# Altium schematic sheet TIDA-010954-Power.SchDoc
size 431 x 279 mm; Date: Not shown in title block; ApprovedBy: Not shown in title block; CheckedBy: Not shown in title block; Author: Not shown in title block; CompanyName: Not shown in title block; Engineer: Not shown in title block; Organization: Not shown in title block; Address1: Not shown in title block; Address2: Not shown in title block; Address3: Not shown in title block; Address4: Not shown in title block; DocumentNumber: 2; Revision: Use project parameter SCH_Rev; SheetNumber: 6; SheetTotal: 9; PageSetup: Record=PageOptions|CenterHorizontal=True|CenterVertical=True|PrintScale=1.00|XCorrection=1.00|YCorrection=1.00|PrintKind=0|BorderSize=5000000|LeftOffset=0|BottomOffset=0|Orientation=2|PaperLength=1000|PaperWidth=1000|Scale=100|PaperSource=15|PrintQuality=600|MediaType=1|DitherType=10|PaperKind=Letter|PrintScaleMode=1; CurrentTime: Not shown in title block; CurrentDate: Not shown in title block; Time: Not shown in title block; DocumentFullPathAndName: Not shown in title block; DocumentName: Not shown in title block; ModifiedDate: 1/25/2022; ImagePath: Not shown in title block
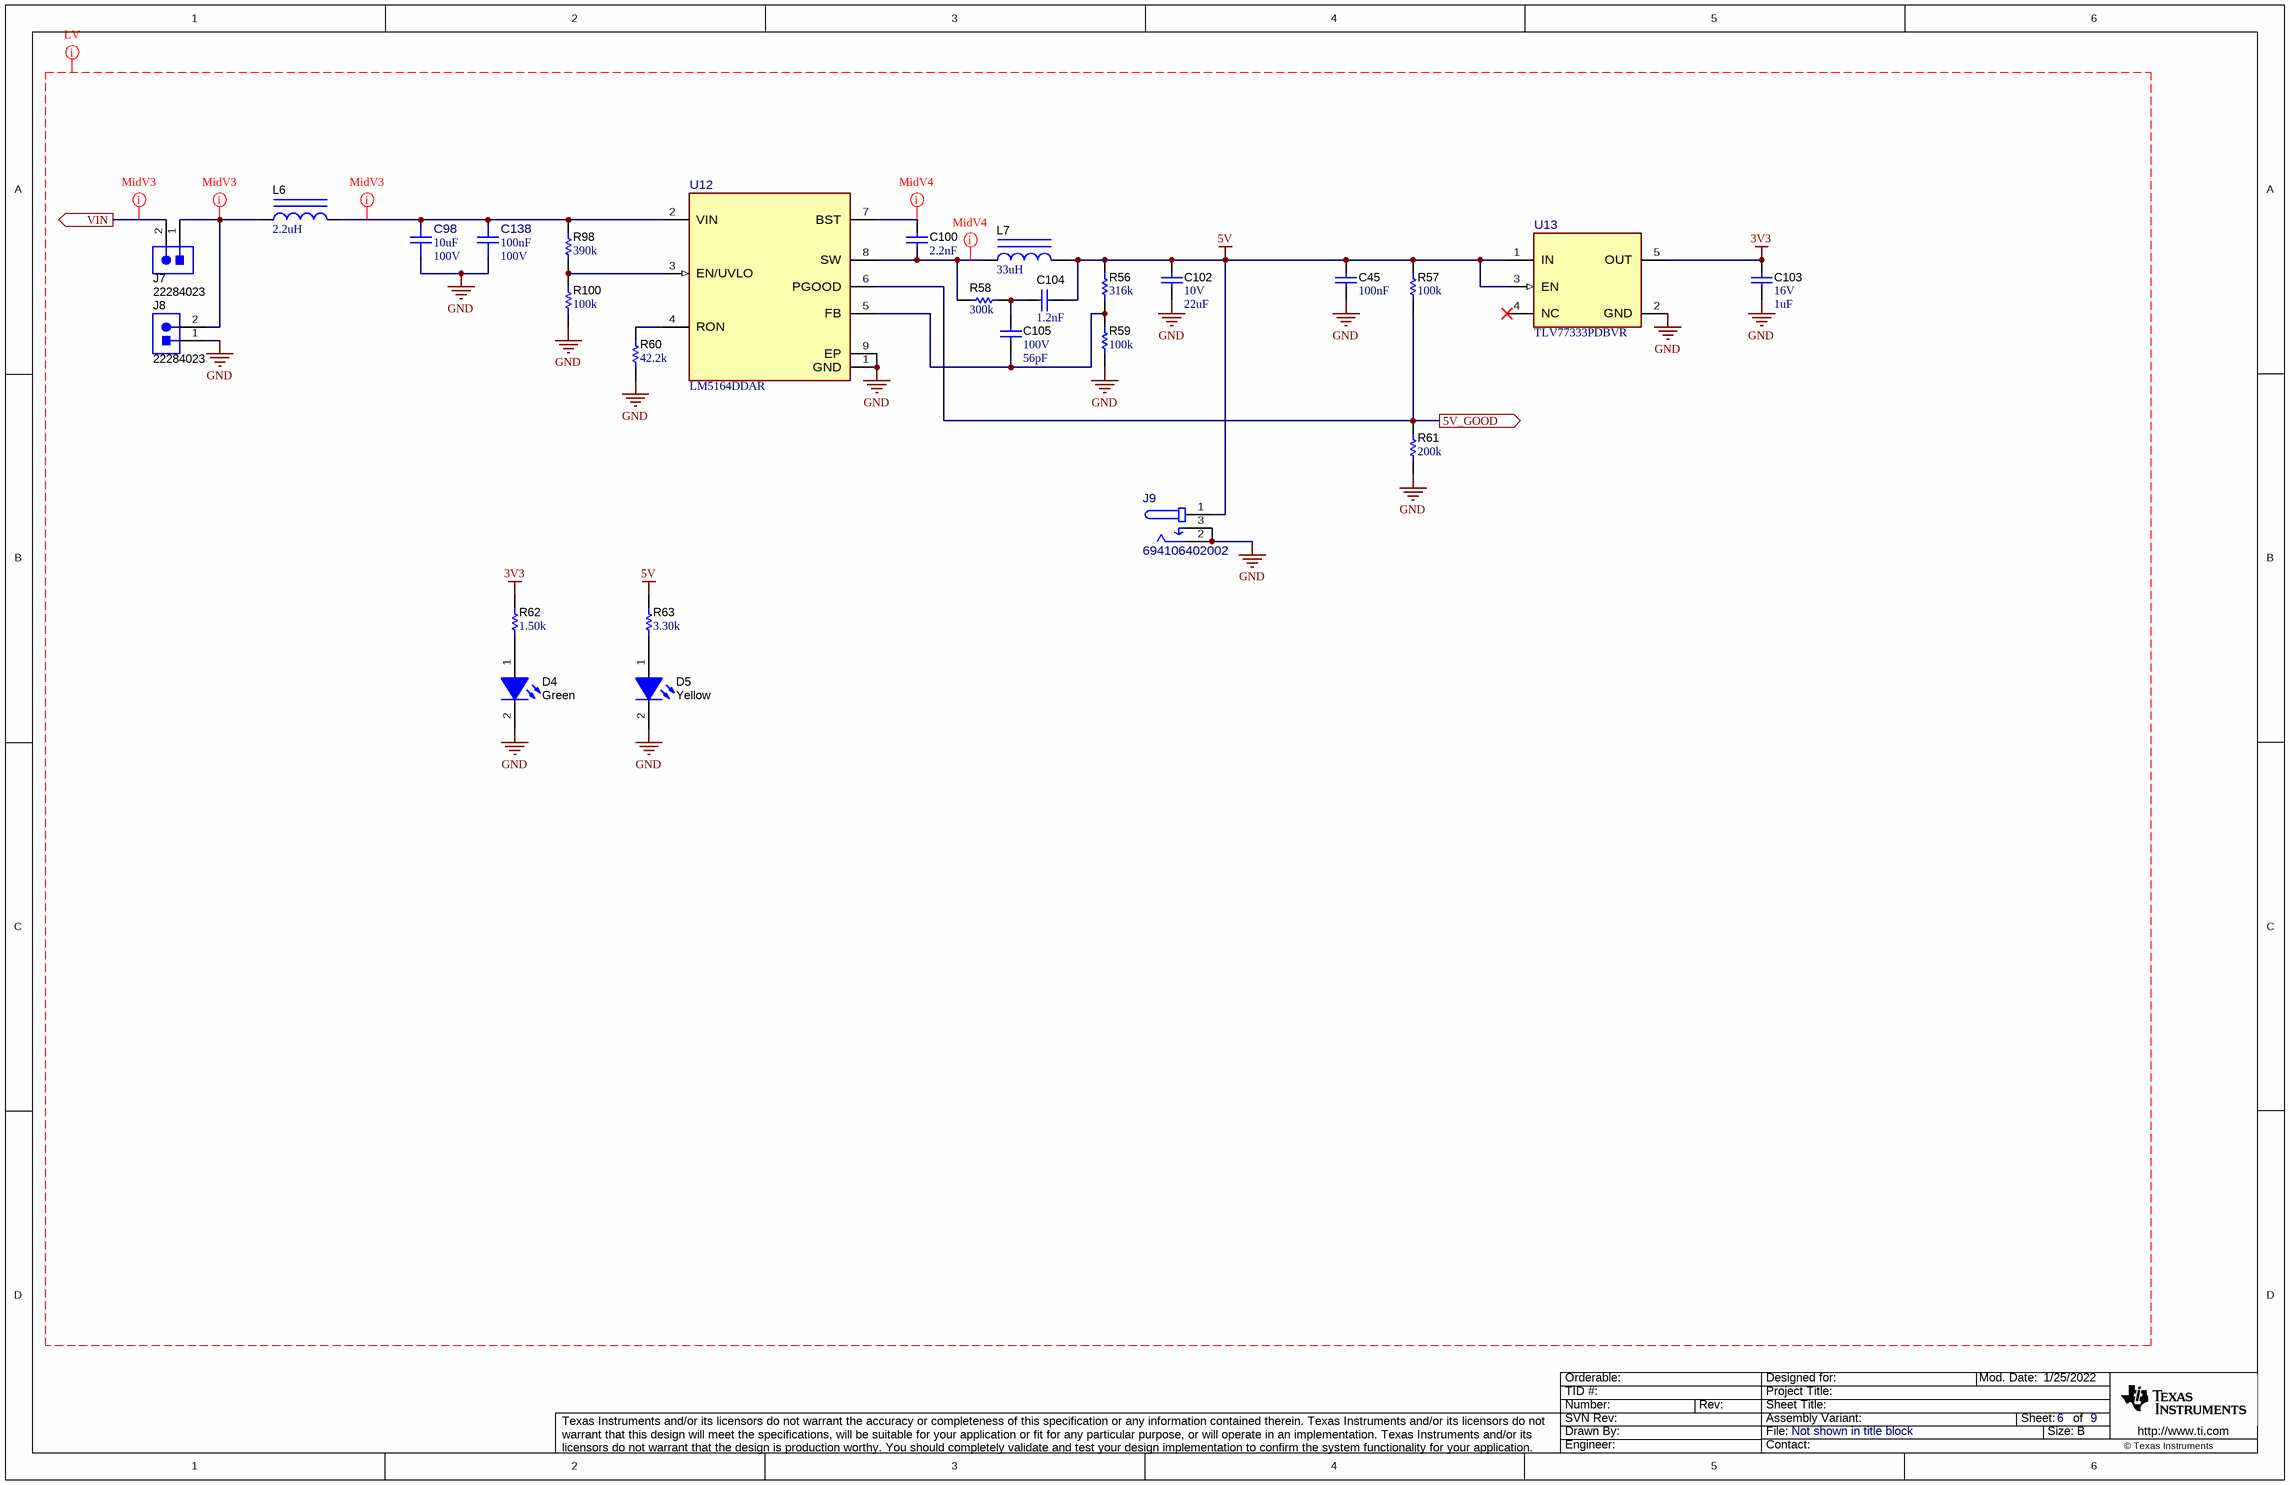
[diagram p0: TIDA-010954-Power.SchDoc]

## Parts
C45  Cap_F: 100nF  [0603]  (hidden comment: CGA3E2X7R1E104K080AA)
C98  ValueDisplayed: 10uF  VDC_V: 100V  [FP-GRM32EC72A106KE05L_1210-MFG]  (hidden comment: GRM32EC72A106KE05L)
C100  Cap_F: 2.2nF  [0603]  (hidden comment: C0603C222K5RAC)
C102  VDC_V: 10V  ValueDisplayed: 22uF  [1206_180]  (hidden comment: GRM31CR71A226KE15L)
C103  VDC_V: 16V  ValueDisplayed: 1uF  [0603]  (hidden comment: GRM185R61C105KE44D)
C104  Cap_F: 1.2nF  [0603]  (hidden comment: GRM188R72A122KA01D)
C105  VDC_V: 100V  ValueDisplayed: 56pF  [0603]  (hidden comment: GRM1885C2A560JA01D)
C138  Cap_F: 100nF  VDC_V: 100V  [FP-GRM188R72A104KA35J_0603-MFG]  (hidden comment: GRM188R72A104KA35J)
D4  value Green  [APT1608_Green]  (hidden comment: APT1608MGC)
D5  value Yellow  [APT1608_Yellow]  (hidden comment: APT1608SYCK)
J7  22284023  [Molex_0022284023]
J8  22284023  [Molex_0022284023]
J9  694106402002  [FP-694106402002_CONN_PWR_10MM7_9MM0-MFG]
L6  ValueDisplayed: 2.2uH  [0805_HV]  (hidden comment: LQM21PN2R2MGS)
L7  ValueDisplayed: 33uH  [SRR1210]  (hidden comment: SRR1210-330M)
R56  ValueDisplayed: 316k  [0603]  (hidden comment: RC0603FR-07316KL)
R57  ValueDisplayed: 100k  [0603]  (hidden comment: RC0603FR-07100KL)
R58  ValueDisplayed: 300k  [0805_HV]  (hidden comment: CRCW0805300KJNEA)
R59  ValueDisplayed: 100k  [0603]  (hidden comment: RC0603FR-07100KL)
R60  ValueDisplayed: 42.2k  [0603]  (hidden comment: RC0603FR-0742K2L)
R61  ValueDisplayed: 200k  [0603]  (hidden comment: RC0603FR-07200KL)
R62  ValueDisplayed: 1.50k  [0603]  (hidden comment: RC0603FR-071K5L)
R63  ValueDisplayed: 3.30k  [0603]  (hidden comment: RC0603FR-073K3L)
R98  ValueDisplayed: 390k  [0805_HV]  (hidden comment: CRCW0805390KJNEA)
R100  ValueDisplayed: 100k  [0603]  (hidden comment: RC0603FR-07100KL)
U12  LM5164DDAR  [DDA0008E-MFG]
U13  TLV77333PDBVR  [DBV0005A-MFG]

## Ports
5V_GOOD (out), VIN (out)

## Nets
3V3: C103.1 R62.2 U13.5(OUT)
5V: C45.2 C102.1 C104.1 J9.1 L7.2 R56.2 R57.2 R63.2 U13.1(IN) U13.3(EN)
GND: C45.1 C98.1 C102.2 C103.2 C138.1 D4.2(K) D5.2(K) J8.1 J9.2 J9.3 R59.1 R60.1 R61.1 R100.1 U12.1(GND) U12.9(EP) U13.2(GND)
5V_GOOD: R57.1 R61.2 U12.6(PGOOD) ; port 5V_GOOD
VIN: J7.2 ; port VIN
NetC98_2: C98.2 C138.2 L6.2 R98.2 U12.2(VIN)
NetC100_1: C100.1 U12.7(BST)
NetC100_2: C100.2 L7.1 R58.1 U12.8(SW)
NetC104_2: C104.2 C105.1 R58.2
NetC105_2: C105.2 R56.1 R59.2 U12.5(FB)
NetD4_1: D4.1(A) R62.1
NetD5_1: D5.1(A) R63.1
NetJ7_1: J7.1 J8.2 L6.1
NetR60_2: R60.2 U12.4(RON)
NetR98_1: R98.1 R100.2 U12.3(EN/UVLO)

Not connected (* = marked no-connect by the designer): U13 4(NC)*

## Layout directives
net class LV: 3V3, 5V, GND
net class MidV3: NetC98_2, NetC100_1, NetC100_2, NetJ7_1, VIN

## Notes on the sheet
- Drawn By:
- SVN Rev:
- Number:
- TID #:
- Orderable:
- Rev:
- Sheet Title:
- File:
- Project Title:
- Designed for:
- Assembly Variant:
- Mod. Date:
- Sheet:
- Size:
- of
- B
- http://www.ti.com
- Texas Instruments and/or its licensors do not warrant the accuracy or completeness of this specification or any information contained therein. Texas Instruments and/or its licensors do not warrant that this design will meet the specifications, will be suitable for your application or fit for any particular purpose, or will operate in an implementation. Texas Instruments and/or its licensors do not warrant that the design is production worthy. You should completely validate and test your design implementation to confirm the system functionality for your application.
- Engineer:
- Contact:
- © Texas Instruments

## Library data of the parts
C45 = CMP-0007077-5: CAP, CERM, 0.1 uF, 25 V, +/- 10%, X7R, AEC-Q200 Grade 1, 0603; Manufacturer: TDK; TaMin_C: -55°C; Polarized: N; SizeAreaWB_mm2: 4.68; Value1: Unknown; U/M: EA; Value: 0.1uF; TaMax_C: 125°C; SizeZ_mm: 1; SizeX_mm: 1.6; SizeY_mm: 0.8; Value2: 25V; SizeArea_mm2: 1.28; AEC Qualified: Y; AEC Category: Q200; Supplier Part Number 2: 79Y4100; Publisher: Texas Instruments; Supplier 2: Newark; Supplier Part Number 3: 810-CGA3E2X7R1E104K; TempCo: X7R; Supplier 3: Mouser; Published: 2008-06-19; RoHS: Y; MountType: SMT; Supplier 1: Digi-Key; PackageReference: 0603; Tolerance_%: 10%; Cap_Case: 0603; CompType: Capacitor; LatestRevisionDate: 2017-03-09; PartNumber: CGA3E2X7R1E104K080AA; VDC_V: 25V; ComponentLink1Description: Datasheet link; AEC Grade: 1; Supplier Part Number 1: 445-5667-1-ND; Technology: Ceramic; ValueDisplayed: 0.1uF; ComponentLink1URL: https://product.tdk.com/info/en/documents/chara_sheet/CGA3E2X7R1E104K080AA.pdf
C98 = CMP-0087970-1: 10µF ±10% 100V Ceramic Capacitor X7S 1210 (3225 Metric); Manufacturer: Murata; Symbol Name: SYM-GRM32EC72A106KE05L; Tolerance_%: 0.1; AEC Qualified: No; TempCo: 22%; SizeZ_mm: 2.7mm; RoHS: TRUE; ComponentLink1Description: Datasheet; ComponentLink1URL: https://search.murata.co.jp/Ceramy/image/img/A01X/G101/ENG/GRM32EC72A106KE05-01A.pdf; PackageReference: 1210; PartNumber: GRM32EC72A106KE05L; Cap_F: 10µF
C100 = CMP-0006897-4: CAP, CERM, 2200 pF, 50 V, +/- 10%, X7R, 0603; Manufacturer: Kemet; TaMin_C: -55°C; Polarized: N; SizeAreaWB_mm2: 4.68; Value1: Unknown; U/M: EA; Value: 2200pF; TaMax_C: 125°C; SizeZ_mm: 1; SizeX_mm: 1.6; SizeY_mm: 0.8; Value2: 50V; SizeArea_mm2: 1.28; AEC Category: Q200; Publisher: Texas Instruments; TempCo: X7R; Published: 2008-06-19; RoHS: Y; MountType: SMT; Supplier 1: Farnell; PackageReference: 0603; Tolerance_%: 10%; Cap_Case: 0603; CompType: Capacitor; LatestRevisionDate: 2017-03-09; PartNumber: C0603C222K5RAC; AEC Qualified: ?; VDC_V: 50V; ComponentLink1Description: Datasheet link; Supplier Part Number 1: 1362428; Technology: Ceramic; ValueDisplayed: 2200pF; ComponentLink1URL: http://www.kemet.com/kemet/web/homepage/kechome.nsf/vapubfiles/F3102_Y5V.pdf/$file/F3102_Y5V.pdf
C102 = CMP-0008959-2: CAP, CERM, 22 uF, 10 V, +/- 10%, X7R, 1206; Manufacturer: MuRata; TaMin_C: -55°C; Polarized: N; SizeAreaWB_mm2: 10.92; Value1: Unknown; U/M: EA; Value: 22uF; TaMax_C: 125°C; SizeZ_mm: 1.8; SizeX_mm: 3.2; SizeY_mm: 1.6; Cap_Case: 1206; SizeArea_mm2: 5.12; Cap_F: 22µF; AEC Category: Q200; Supplier Part Number 2: 81-GRM31CR71A226K15L; Publisher: Texas Instruments; Supplier 2: Mouser; Supplier Part Number 3: 1797016; TempCo: X7R; Supplier 3: Farnell; Published: 2008-06-19; RoHS: Y; MountType: SMT; Supplier 1: Digi-Key; PackageReference: 1206; Tolerance_%: 10%; Value2: 10V; CompType: Capacitor; LatestRevisionDate: 2017-03-09; PartNumber: GRM31CR71A226KE15L; AEC Qualified: ?; ComponentLink1Description: Datasheet link; Supplier Part Number 1: 490-5309-1-ND; Technology: Ceramic; ComponentLink1URL: http://search.murata.co.jp/Ceramy/PnsearchViewAction.do?HnOFG=ON&HnNFG=ON&SEL_CNT=50&sLang=en&sKey=GRM31CR71A226KE15L&x=9&y=9&search=startwith
C103 = CMP-0007157-5: CAP, CERM, 1 uF, 16 V, +/- 10%, X5R, 0603; Manufacturer: MuRata; TaMin_C: -55°C; Polarized: N; SizeAreaWB_mm2: 4.68; Value1: Unknown; U/M: EA; Value: 1uF; TaMax_C: 85°C; SizeZ_mm: 1; SizeX_mm: 1.6; SizeY_mm: 0.8; SizeArea_mm2: 1.28; Cap_F: 1µF; AEC Category: Q200; Supplier Part Number 2: 81-GRM185R61C105KE44; Publisher: Texas Instruments; Supplier 2: Mouser; Supplier Part Number 3: 1845733; TempCo: X5R; Supplier 3: Farnell; Published: 2008-06-19; RoHS: Y; MountType: SMT; Supplier 1: Digi-Key; PackageReference: 0603; Tolerance_%: 10%; Cap_Case: 0603; Value2: 16V; CompType: Capacitor; LatestRevisionDate: 2017-03-09; PartNumber: GRM185R61C105KE44D; AEC Qualified: ?; ComponentLink1Description: Datasheet link; Supplier Part Number 1: 490-3894-1-ND; Technology: Ceramic; ComponentLink1URL: http://search.murata.co.jp/Ceramy/PnsearchViewAction.do?HnOFG=ON&HnNFG=ON&SEL_CNT=50&sLang=en&sKey=GRM185R61C105KE44D&x=9&y=9&search=startwith
C104 = CMP-0007471-5: CAP, CERM, 1200 pF, 100 V, +/- 10%, X7R, 0603; Manufacturer: MuRata; TaMin_C: -55°C; Polarized: N; SizeAreaWB_mm2: 4.68; Value1: Unknown; U/M: EA; Value: 1200pF; TaMax_C: 125°C; SizeZ_mm: 1; SizeX_mm: 1.6; SizeY_mm: 0.8; Value2: 100V; SizeArea_mm2: 1.28; AEC Category: Q200; Supplier Part Number 2: 81-GRM18R72A122KA01D; Publisher: Texas Instruments; Supplier 2: Mouser; TempCo: X7R; Published: 2008-06-19; RoHS: Y; MountType: SMT; Supplier 1: Digi-Key; PackageReference: 0603; Tolerance_%: 10%; Cap_Case: 0603; CompType: Capacitor; LatestRevisionDate: 2017-03-09; PartNumber: GRM188R72A122KA01D; AEC Qualified: ?; VDC_V: 100V; ComponentLink1Description: Datasheet link; Supplier Part Number 1: 490-1474-1-ND; Technology: Ceramic; ValueDisplayed: 1200pF; ComponentLink1URL: http://search.murata.co.jp/Ceramy/PnsearchViewAction.do?HnOFG=ON&HnNFG=ON&SEL_CNT=50&sLang=en&sKey=GRM188R72A122KA01D&x=9&y=9&search=startwith
C105 = CMP-0007275-4: CAP, CERM, 56 pF, 100 V, +/- 5%, C0G/NP0, 0603; Manufacturer: MuRata; TaMin_C: -55°C; Polarized: N; SizeAreaWB_mm2: 4.68; Value1: Unknown; U/M: EA; Value: 56pF; TaMax_C: 125°C; SizeZ_mm: 1; SizeX_mm: 1.6; SizeY_mm: 0.8; SizeArea_mm2: 1.28; AEC Category: Q200; Supplier Part Number 2: 81-GRM185C2A560JA01D; Publisher: Texas Instruments; Supplier 2: Mouser; TempCo: C0G/NP0; Published: 2008-06-19; RoHS: Y; MountType: SMT; Supplier 1: Digi-Key; PackageReference: 0603; Tolerance_%: 5%; Cap_Case: 0603; Value2: 100V; CompType: Capacitor; LatestRevisionDate: 2017-03-09; PartNumber: GRM1885C2A560JA01D; Cap_F: 56pF; ComponentLink1Description: Datasheet link; Supplier Part Number 1: 490-1345-1-ND; Technology: Ceramic; AEC Qualified: ?; ComponentLink1URL: http://search.murata.co.jp/Ceramy/PnsearchViewAction.do?HnOFG=ON&HnNFG=ON&SEL_CNT=50&sLang=en&sKey=GRM1885C2A560JA01D&x=9&y=9&search=startwith
C138 = CMP-0122713-1: Chip Multilayer Ceramic Capacitors for General Purpose, 0603, 0.10uF, X7R, 15%, 10%, 100V; Manufacturer: Murata; AEC Qualified: No; SizeZ_mm: 0.9mm; Value: 100nF; PackageReference: 0603; PartNumber: GRM188R72A104KA35J; RoHS: TRUE; TempCo: 15%; Tolerance_%: 10%; ValueDisplayed: 0.10uF; Part Number: GRM188R72A104KA35J; datasheet: https://www.murata.com/en-us/products/productdetail?partno=GRM188R72A104KA35%23; Datasheet Path: datasheets/Cap-GRM188R72A104KA35J.pdf; helpURL: https://upverter.com/upn/revision/71520f38ae33ed89/; Lead Free: Yes; Operating Temperature Range: -55°C to +125°C; Temperature Characteristic: X7R; ComponentLink1Description: Datasheet; ComponentLink1URL: https://www.murata.com/en-us/products/productdetail?partno=GRM188R72A104KA35%23
D4 = CMP-0002943-3: LED, Green, SMD; Manufacturer: Kingbright; Value2: 2.1V; Vr_V: 5V; Ir_A: 10µA; Io_A: 20mA; Angle: 120; Tjmax_C: 85°C; Value1: W; CompType: LED; MountType: SMT; Color: Green; ComponentLink1Description: Datasheet link; PackageReference: 0603(1608); RoHS: Y; PartNumber: APT1608MGC; Vf_V: 2.1V; Type: ?; ComponentLink1URL: http://www.kingbrightusa.com/images/catalog/SPEC/APT1608MGC.pdf
D5 = CMP-0002944-3: LED, Yellow, SMD; Manufacturer: Kingbright; Value2: 2.5V; Ir_A: 10µA; Tjmax_C: 85°C; Value1: W; Io_A: 20mA; Vr_V: 5V; Angle: 120; Color: yellow; CompType: LED; MountType: SMT; RoHS: Y; ComponentLink1URL: http://www.kingbrightusa.com/images/catalog/SPEC/APT1608SYCK.pdf; Type: ?; PackageReference: 0603(1608); ComponentLink1Description: Datasheet link; Vf_V: 2.5V; PartNumber: APT1608SYCK
J7 J8 = CMP-0055333-1: Header, 2.54mm, 2x1, Tin, TH; Manufacturer: Molex; CNHeader: TRUE; Current_A: 4A; Shrouded: N; Gender: Male; Voltage_V: 250V; Row_Count: 1; Pitch_mm: 2.54; CT: FALSE; Cert_UL: Y; ComponentLink1URL: http://www.molex.com/pdm_docs/sd/022284023_sd.pdf; ClassName: Header; Publisher: Texas Instruments; Color: Black; RoHS: Y; MountType: TH; Supplier 1: Digi-Key; PackageReference: Header, 2.54mm, 2x1, TH; PinCount: 2; CompType: Header; LatestRevisionDate: 26/05/2017; PartNumber: 22284023; Orientation: Vertical; ComponentLink1Description: Datasheet URL; Supplier Part Number 1: WM50016-02-ND; ContactFinish: Tin
J9 = CMP-0040211-1: Power Barrel Connector Jack 2.10mm ID (0.083"), 5.50mm OD (0.217") Through Hole; Manufacturer: Wurth Electronics; ContactFinish: Gold; Current_A: 3A; Voltage_V: 30V; AEC Qualified: No; Conn Gender: Female; Conn Orientation: Vertical; SizeZ_mm: 14.3mm; PackageReference: CONN_PWR_10MM7_9MM0; PartNumber: 694106402002; PinCount: 1; RoHS: TRUE; Supplier 1: Digikey; Supplier 2: Mouser; Supplier Part Number 1: 732-5931-ND; Supplier Part Number 2: 710-694106402002; Part Number: 694106402002; datasheet: https://www.we-online.com/components/products/datasheet/694106402002.pdf; Datasheet Path: datasheets/Conn-694106402002.pdf; Digikey Description: CONN PWR JACK 2.1X5.5MM SOLDER; Digikey Part Number: 732-5931-ND; helpURL: https://upverter.com/upn/revision/1809d497b2602ff5/; Lead Free: Yes; Mouser Description: DC Power Jack Connector WR-DC, Male, Vertical, THT, 3 A, 20 V; Mouser Part Number: 710-694106402002; Operating Temperature Range: -40°C to +85°C; ComponentLink1Description: Datasheet; ComponentLink1URL: https://www.we-online.com/components/products/datasheet/694106402002.pdf
L6 = CMP-0058745-1: Inductor, Multilayer, Ferrite, 2.2 uH, 0.95 A, 0.18 ohm, SMD; Manufacturer: MuRata; Green_Lifecycle: Active; SizeAreaWB_mm2: 6.75; DCR_ohm: 1.8d; Green_REACh: Passed; Value: 2.2uH; Imax_A: 9.5dA; SizeZ_mm: 1.45; SizeX_mm: 2; SizeY_mm: 1.25; Value2: 0.95A; SizeArea_mm2: 2.5; Ind_H: 2.2µH; AEC Category: Q200; ComponentLink1URL: http://www.murata.com/products/catalog/pdf/o05e.pdf; Publisher: Texas Instruments; Published: 2008-06-26; RoHS: Y; Value1: 0.18 ohm; Material: Ferrite; MountType: SMT; Green_EU RoHS-2: Incomplete; Supplier 1: Digi-Key; Green_EU RoHS: Passed; PackageReference: 0805; CompType: Inductor; LatestRevisionDate: 2017-06-02; PartNumber: LQM21PN2R2MGS; AEC Qualified: ?; ComponentLink1Description: Datasheet link; Supplier Part Number 1: LQM21PN2R2MGSD-ND; Technology: Multilayer
L7 = CMP-0057850-2: Inductor, Drum Core, Ferrite, 33 uH, 3.7 A, 0.052 ohm, SMD; Manufacturer: Bourns; Isat: 3.7A @ 20% inductance drop; Irms: 4.4A @ 40C rise; Green_Lifecycle: Active; SizeAreaWB_mm2: 196; DCR_ohm: 0.052; Green_REACh: Passed; Value: 33uH; Imax_A: 3.7A; SizeZ_mm: 10; SizeX_mm: 12; SizeArea_mm2: 144; Ind_H: 33µH; AEC Category: Q200; Supplier Part Number 2: 652-SRR1210-330M; Publisher: Texas Instruments; Supplier 2: Mouser; Published: 2008-06-26; RoHS: Y; Value1: 0.052 ohm; Material: Ferrite; MountType: SMT; Green_EU RoHS-2: Incomplete; Supplier 1: Digi-Key; Green_EU RoHS: Passed; PackageReference: 12x10x12mm; SizeY_mm: 12; Value2: 3.7A; CompType: Inductor; LatestRevisionDate: 2017-06-02; PartNumber: SRR1210-330M; AEC Qualified: ?; ComponentLink1Description: Datasheet link; Supplier Part Number 1: SRR1210-330MCT-ND; Technology: Drum Core; ComponentLink1URL: http://www.bourns.com/data/global/pdfs/SRR1210.pdf
R56 = CMP-0023024-4: RES, 316 k, 1%, 0.1 W, 0603; Manufacturer: Yageo; Power_W: 100mW; TempCo: 100 ppm/C; Value: 316k; EIA_Code: E96; SizeX_mm: 1.6; SizeY_mm: 0.8; SizeZ_mm: 1; Value2: 0.1W; SizeArea_mm2: 1.28; AEC Qualified: N; VDC_V: 75V; AEC Category: Q200; SizeAreaWB_mm2: 4.68; ComponentLink1URL: http://www.yageo.com/pdf/Pu-RC0603_51_PbFree_L_2.pdf; Supplier Part Number 2: 603-RC0603FR-07316KL; Supplier 2: Mouser; Value_Code: 316k; RoHS: Y; Value1: 1%; MountType: SMT; Supplier 1: Digi-Key; PackageReference: 0603; Tolerance_%: 1%; Res_ohm: 316k; CompType: Resistor; PartNumber: RC0603FR-07316KL; ComponentLink1Description: Datasheet link; Supplier Part Number 1: 311-316KHRCT-ND; Technology: Thick Film; AEC Grade: N/A
R57 R59 R100 = CMP-0022735-5: RES, 100 k, 1%, 0.1 W, 0603; Manufacturer: Yageo; Power_W: 100mW; TempCo: 100 ppm/C; Value: 100k; EIA_Code: E96; SizeX_mm: 1.6; SizeY_mm: 0.8; SizeZ_mm: 1; Value2: 0.1W; SizeArea_mm2: 1.28; AEC Qualified: N; VDC_V: 75V; AEC Category: Q200; SizeAreaWB_mm2: 4.68; Supplier Part Number 2: 603-RC0603FR-07100KL; Supplier 2: Mouser; Supplier Part Number 3: 9238727; Supplier 3: Farnell; Value_Code: 100k; RoHS: Y; Value1: 1%; MountType: SMT; Supplier 1: Digi-Key; PackageReference: 0603; Tolerance_%: 1%; Res_ohm: 100k; CompType: Resistor; PartNumber: RC0603FR-07100KL; ComponentLink1Description: Datasheet link; Supplier Part Number 1: 311-100KHRCT-ND; Technology: Thick Film; ComponentLink1URL: http://www.yageo.com/pdf/Pu-RC0603_51_PbFree_L_2.pdf; AEC Grade: N/A
R58 = CMP-0020522-3: RES, 300 k, 5%, 0.125 W, AEC-Q200 Grade 0, 0805; Manufacturer: Vishay-Dale; Power_W: 125mW; TempCo: 200 ppm/C; Value: 300k; EIA_Code: E24; SizeX_mm: 2; SizeY_mm: 1.25; SizeZ_mm: 1.45; Value2: 0.125W; SizeArea_mm2: 2.5; AEC Qualified: Y; VDC_V: 150V; AEC Category: Q200; AEC Grade: 0; Value_Code: 300k; RoHS: E; Value1: 5%; MountType: SMT; Supplier 1: Digi-Key; PackageReference: 0805; Tolerance_%: 5%; Res_ohm: 300k; CompType: Resistor; PartNumber: CRCW0805300KJNEA; ComponentLink1Description: Datasheet link; Supplier Part Number 1: 541-300KACT-ND; Technology: Thick Film; ComponentLink1URL: http://www.vishay.com/docs/20035/dcrcwe3.pdf
R60 = CMP-0023106-5: RES, 42.2 k, 1%, 0.1 W, 0603; Manufacturer: Yageo; Power_W: 100mW; TempCo: 100 ppm/C; Value_Code: 42k2; Value: 42.2k; EIA_Code: E96; SizeX_mm: 1.6; SizeY_mm: 0.8; SizeZ_mm: 1; Value2: 0.1W; SizeArea_mm2: 1.28; AEC Qualified: N; VDC_V: 75V; AEC Category: Q200; SizeAreaWB_mm2: 4.68; Supplier Part Number 2: 603-RC0603FR-0742K2L; Supplier 2: Mouser; RoHS: Y; Value1: 1%; MountType: SMT; Supplier 1: Digi-Key; PackageReference: 0603; Tolerance_%: 1%; Res_ohm: 42.2k; CompType: Resistor; PartNumber: RC0603FR-0742K2L; ComponentLink1Description: Datasheet link; Supplier Part Number 1: 311-42.2KHRCT-ND; Technology: Thick Film; ComponentLink1URL: http://www.yageo.com/pdf/Pu-RC0603_51_PbFree_L_2.pdf; AEC Grade: N/A
R61 = CMP-0022901-4: RES, 200 k, 1%, 0.1 W, 0603; Manufacturer: Yageo; Power_W: 100mW; TempCo: 100 ppm/C; Value: 200k; EIA_Code: E96; SizeX_mm: 1.6; SizeY_mm: 0.8; SizeZ_mm: 1; Value2: 0.1W; AEC Qualified: N; VDC_V: 75V; AEC Category: Q200; SizeArea_mm2: 1.28; SizeAreaWB_mm2: 4.68; ComponentLink1URL: http://www.yageo.com/pdf/Pu-RC0603_51_PbFree_L_2.pdf; Supplier Part Number 2: 603-RC0603FR-07200KL; Supplier 2: Mouser; Supplier Part Number 3: 1799334; Supplier 3: Farnell; Value_Code: 200k; RoHS: Y; Value1: 1%; MountType: SMT; Supplier 1: Digi-Key; PackageReference: 0603; Tolerance_%: 1%; Res_ohm: 200k; CompType: Resistor; PartNumber: RC0603FR-07200KL; ComponentLink1Description: Datasheet link; Supplier Part Number 1: 311-200KHRCT-ND; Technology: Thick Film; AEC Grade: N/A
R62 = CMP-0022883-5: RES, 1.50 k, 1%, 0.1 W, 0603; Manufacturer: Yageo; Power_W: 100mW; TempCo: 100 ppm/C; Value_Code: 1k50; Value: 1.50k; EIA_Code: E96; Res_ohm: 1.5k; SizeX_mm: 1.6; SizeY_mm: 0.8; SizeZ_mm: 1; Value2: 0.1W; SizeArea_mm2: 1.28; AEC Qualified: N; VDC_V: 75V; AEC Category: Q200; SizeAreaWB_mm2: 4.68; Supplier Part Number 2: 603-RC0603FR-071K5L; Supplier 2: Mouser; Supplier Part Number 3: 9238506; Supplier 3: Farnell; RoHS: Y; Value1: 1%; MountType: SMT; Supplier 1: Digi-Key; PackageReference: 0603; Tolerance_%: 1%; CompType: Resistor; PartNumber: RC0603FR-071K5L; ComponentLink1Description: Datasheet link; Supplier Part Number 1: 311-1.50KHRCT-ND; Technology: Thick Film; ComponentLink1URL: http://www.yageo.com/pdf/Pu-RC0603_51_PbFree_L_2.pdf; AEC Grade: N/A
R63 = CMP-0023081-5: RES, 3.30 k, 1%, 0.1 W, 0603; Manufacturer: Yageo; Power_W: 100mW; TempCo: 100 ppm/C; Value_Code: 3k30; Value: 3.30k; Res_ohm: 3.3k; SizeX_mm: 1.6; SizeY_mm: 0.8; SizeZ_mm: 1; Value2: 0.1W; SizeArea_mm2: 1.28; AEC Qualified: N; VDC_V: 75V; AEC Category: Q200; SizeAreaWB_mm2: 4.68; Supplier Part Number 2: 603-RC0603FR-073K3L; Supplier 2: Mouser; Supplier Part Number 3: 9238549; Supplier 3: Farnell; RoHS: Y; Value1: 1%; MountType: SMT; Supplier 1: Digi-Key; PackageReference: 0603; Tolerance_%: 1%; CompType: Resistor; PartNumber: RC0603FR-073K3L; ComponentLink1Description: Datasheet link; Supplier Part Number 1: 311-3.30KHRCT-ND; Technology: Thick Film; ComponentLink1URL: http://www.yageo.com/pdf/Pu-RC0603_51_PbFree_L_2.pdf; AEC Grade: N/A
R98 = CMP-0020534-3: RES, 390 k, 5%, 0.125 W, AEC-Q200 Grade 0, 0805; Manufacturer: Vishay-Dale; Power_W: 125mW; TempCo: 200 ppm/C; Value: 390k; EIA_Code: E24; SizeX_mm: 2; SizeY_mm: 1.25; SizeZ_mm: 1.45; Value2: 0.125W; SizeArea_mm2: 2.5; AEC Qualified: Y; VDC_V: 150V; AEC Category: Q200; AEC Grade: 0; Supplier Part Number 2: 59M6896; Supplier 2: Newark; Supplier Part Number 3: 71-CRCW0805390KJNEA; Supplier 3: Mouser; Value_Code: 390k; RoHS: E; Value1: 5%; MountType: SMT; Supplier 1: Digi-Key; PackageReference: 0805; Tolerance_%: 5%; Res_ohm: 390k; CompType: Resistor; PartNumber: CRCW0805390KJNEA; ComponentLink1Description: Datasheet link; Supplier Part Number 1: 541-390KACT-ND; Technology: Thick Film; ComponentLink1URL: http://www.vishay.com/docs/20035/dcrcwe3.pdf
U12 = CMP-0089262-2: Manufacturer: Texas Instruments; AEC Qualified: No; Standoff Height: 0mm; AEC Category: Q200; Max Duty Cycle: 99%; Nominal Supply Current: 600uA; Max Supply Voltage: 100V; Number Of Outputs: 1; Switching Frequency: 1MHz; Output Type: AdjustableProgrammable; Switching Topology: Buck; Min Supply Voltage: 6V; CompType: IC; Output Voltage: 1.2-90V; TJmax_C: +150°C; RoHS: TRUE; Lead Free: Yes; Mouser Description: 6-V to 100-V input, 1-A synchronous buck DC-DC converter with ultra-low IQ 8-SO PowerPAD -40 to 150; ComponentLink2Description: Product Folder; PartNumber: LM5164DDAR; helpURL: https://upverter.com/upn/revision/f50a14a06c929ee3/; Digikey Description: POWER MANAGEMENT; ComponentLink3URL: http://www.ti.com/product/GPN/datasheet; Mouser Part Number: 595-LM5164DDAR; Device Class L1: Integrated Circuits (ICs); Device Class L3: Voltage Regulators - Switching; Device Class L2: Power Management ICs; ComponentLink2URL: http://www.ti.com/product/GPN; ComponentLink3Description: Online Datasheet; Part Number: LM5164DDAR; PackageReference: SOPowerPAD8; ComponentLink1Description: Datasheet; Datasheet Path: datasheets/IC-LM5164DDAR.pdf; datasheet: http://www.ti.com/lit/ds/symlink/lm5164.pdf; Digikey Part Number: 296-LM5164DDARCT-ND; ComponentLink1URL: http://www.ti.com/lit/ds/symlink/lm5164.pdf; Operating Temperature Range: -40°C to +150°C
U13 = CMP-0033468-1: 300-mA, Small-Size, High-PSRR LDO; Manufacturer: Texas Instruments; SizeZ_mm: 1.45mm; AEC Qualified: No; Accuracy Percentage: 1%; Dropout Voltage: 200mV; Max Supply Voltage: 5.5V; Min Supply Voltage: 3.8V; Nominal Supply Current: 80uA; Number Of Outputs: 1; Output Type: Fixed; Output Voltage: 3.3V; Standoff Height: 0mm; TJmax_C: +85°C; PackageReference: SOT23-5; PartNumber: TLV77333PDBVR; RoHS: UNKNOWN; Operating Temperature Range: -40°C to +85°C; Part Number: TLV77333PDBVR; Datasheet Path: datasheets/IC-TLV77333PDBVR.pdf; helpURL: https://upverter.com/upn/revision/a8015f0933e53857/; Lead Free: Yes